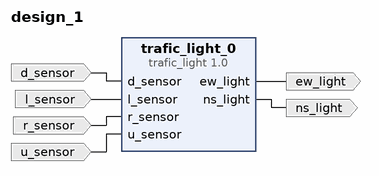
[diagram p0: block diagram of the top level]
# Vivado block design design_1, xc7z020clg484-1, Vivado 2019.2
create_bd_design design_1

create_bd_port -dir I -type data d_sensor
create_bd_port -dir O -type data ew_light
create_bd_port -dir I -type data l_sensor
create_bd_port -dir O -type data ns_light
create_bd_port -dir I -type data r_sensor
create_bd_port -dir I -type data u_sensor

create_bd_cell -type ip -vlnv xilinx.com:hls:trafic_light:1.0 trafic_light_0

# ---- connections ----

connect_bd_net -net d_sensor_0_1 [get_bd_ports d_sensor] [get_bd_pins trafic_light_0/d_sensor]
connect_bd_net [get_bd_pins trafic_light_0/ew_light] [get_bd_ports ew_light]
connect_bd_net -net l_sensor_0_1 [get_bd_ports l_sensor] [get_bd_pins trafic_light_0/l_sensor]
connect_bd_net [get_bd_pins trafic_light_0/ns_light] [get_bd_ports ns_light]
connect_bd_net -net r_sensor_0_1 [get_bd_ports r_sensor] [get_bd_pins trafic_light_0/r_sensor]
connect_bd_net -net u_sensor_0_1 [get_bd_ports u_sensor] [get_bd_pins trafic_light_0/u_sensor]

validate_bd_design
save_bd_design
